# EAGLE design analog_adapter (EAGLE 6.5.0)
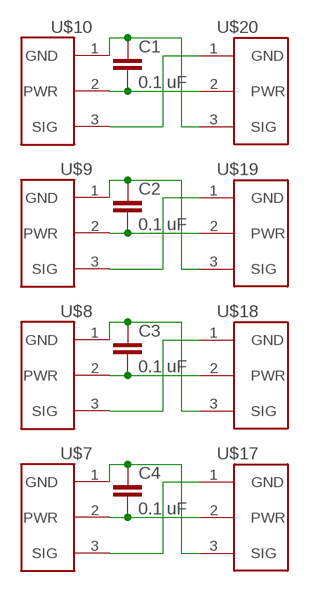
[diagram p0: schematic, sheet 1]

## Parts
C1  0.1 uF  CAP0603  [0603]
C2  0.1 uF  CAP0603  [0603]
C3  0.1 uF  CAP0603  [0603]
C4  0.1 uF  CAP0603  [0603]
U$7  22-23-2031GENERIC  [PWM_1X3]
U$8  22-23-2031GENERIC  [PWM_1X3]
U$9  22-23-2031GENERIC  [PWM_1X3]
U$10  22-23-2031GENERIC  [PWM_1X3]
U$17  22-23-2031  [22-23-2031]
U$18  22-23-2031  [22-23-2031]
U$19  22-23-2031  [22-23-2031]
U$20  22-23-2031  [22-23-2031]

## Nets
N$1: C1.1 U$10.1(GND) U$20.3(SIG)
N$2: C1.2 U$10.2(PWR) U$20.2(PWR)
N$3: U$10.3(SIG) U$20.1(GND)
N$5: C2.2 U$9.2(PWR) U$19.2(PWR)
N$6: U$9.3(SIG) U$19.1(GND)
N$8: C3.2 U$8.2(PWR) U$18.2(PWR)
N$9: U$8.3(SIG) U$18.1(GND)
N$11: C4.2 U$7.2(PWR) U$17.2(PWR)
N$12: U$7.3(SIG) U$17.1(GND)
N$22: C4.1 U$7.1(GND) U$17.3(SIG)
N$25: C3.1 U$8.1(GND) U$18.3(SIG)
N$28: C2.1 U$9.1(GND) U$19.3(SIG)

## Library data of the parts
C1-C4 = custom:CAP: Capacitor Standard 0603 ceramic capacitor, and 0.1" leaded capacitor.
U$7-U$10 U$17-U$20 = custom:22-23-2031: Molex 3-pin male connector 22-23-2031.

## Board
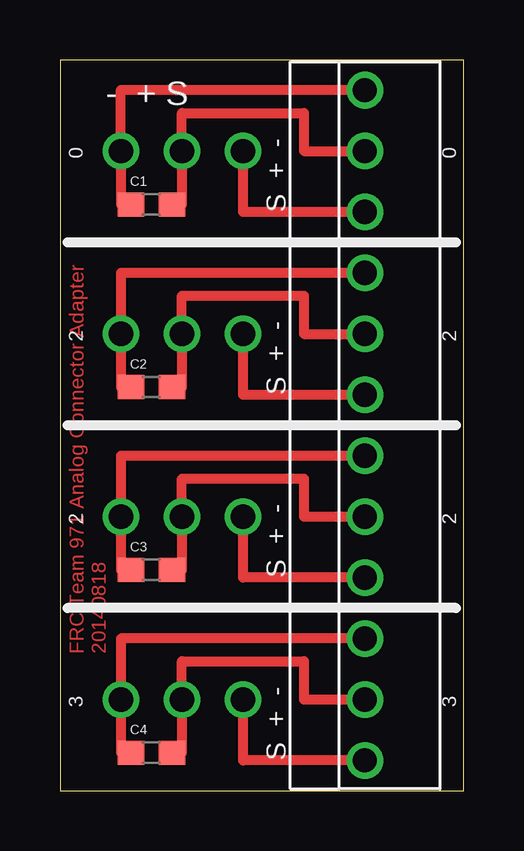
[diagram p1: board, top side]
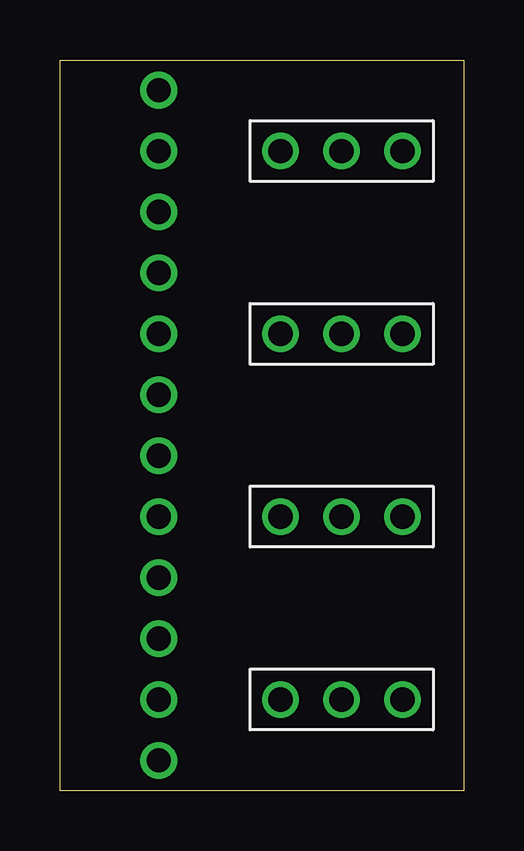
[diagram p2: board, bottom side, seen from below]

Size 16.82 x 30.47 mm. Coordinates in mm from the lower left corner, seen from the top.
Outline: 0,0 16.82,0 16.82,30.47 0,30.47 0,0
Copper layers (1*16): Top 0.035mm / dielectric 1.5mm / Bottom 0.035mm
Design rules "SeeedStudio_2layer_DRU_no_angle_20140221 *": minimum track width 6mil, minimum drill 12mil, track to track 6mil, track to pad 6mil, pad to pad 6mil, via to via 6mil, smd to smd 0mil, copper to edge 10mil, drill to drill 10mil, minimum pad ring 10mil, minimum via ring 6mil, stop-mask expansion 2mil, vias tented up to drill 100mil, thermal gap 10mil

### Footprints (pad centres in the part's own frame; a part is rotated, then mirrored left to right if it is on the bottom)
0603 = smd 1.1 x 1: 1 -0.85,0; 2 0.85,0
PWM_1X3 = drill 1.016: 1 0,2.54; 2 0,0; 3 0,-2.54
22-23-2031 = drill 1.016: 1 0,2.54; 2 0,0; 3 0,-2.54

### Placement (x,y rotation side)
C1  3.81,24.45 0 top
C2  3.81,16.83 0 top
C3  3.81,9.21 0 top
C4  3.81,1.59 0 top
U$7  5.08,3.81 270 bottom
U$8  5.08,11.43 270 bottom
U$9  5.08,19.05 270 bottom
U$10  5.08,26.67 270 bottom
U$17  12.7,3.81 180 top
U$18  12.7,11.43 180 top
U$19  12.7,19.05 180 top
U$20  12.7,26.67 180 top

### Tracks (layer width: path | path; a pad name or v marks a point on that pad's centre or on a via)
N$1
  Top 0.406: C1.1 2.54,24.45 U$10.1 2.54,29.21 U$20.3
N$2
  Top 0.406: U$20.2 10.16,26.67 10.16,28.26 5.08,28.26 U$10.2 5.08,24.45 C1.2
N$3
  Top 0.406: U$10.3 7.62,24.13 U$20.1
N$5
  Top 0.406: U$19.2 10.16,19.05 10.16,20.64 5.08,20.64 U$9.2 5.08,16.83 C2.2
N$6
  Top 0.406: U$9.3 7.62,16.51 U$19.1
N$8
  Top 0.406: U$18.2 10.16,11.43 10.16,13.02 5.08,13.02 U$8.2 5.08,9.21 C3.2
N$9
  Top 0.406: U$8.3 7.62,8.89 U$18.1
N$11
  Top 0.406: U$17.2 10.16,3.81 10.16,5.4 5.08,5.4 U$7.2 5.08,1.59 C4.2
N$12
  Top 0.406: U$7.3 7.62,1.27 U$17.1
N$22
  Top 0.406: C4.1 2.54,1.59 U$7.1 2.54,6.35 U$17.3
N$25
  Top 0.406: C3.1 2.54,9.21 U$8.1 2.54,13.97 U$18.3
N$28
  Top 0.406: C2.1 2.54,16.83 U$9.1 2.54,21.59 U$19.3

### Text on the board
Top: FRC Team 971 Analog Connector Adapter / 20140818
tPlace: - + S | 0 | 0 | S + - | 2 | 2 | S + - | 2 | 2 | S + - | 3 | 3 | S + -